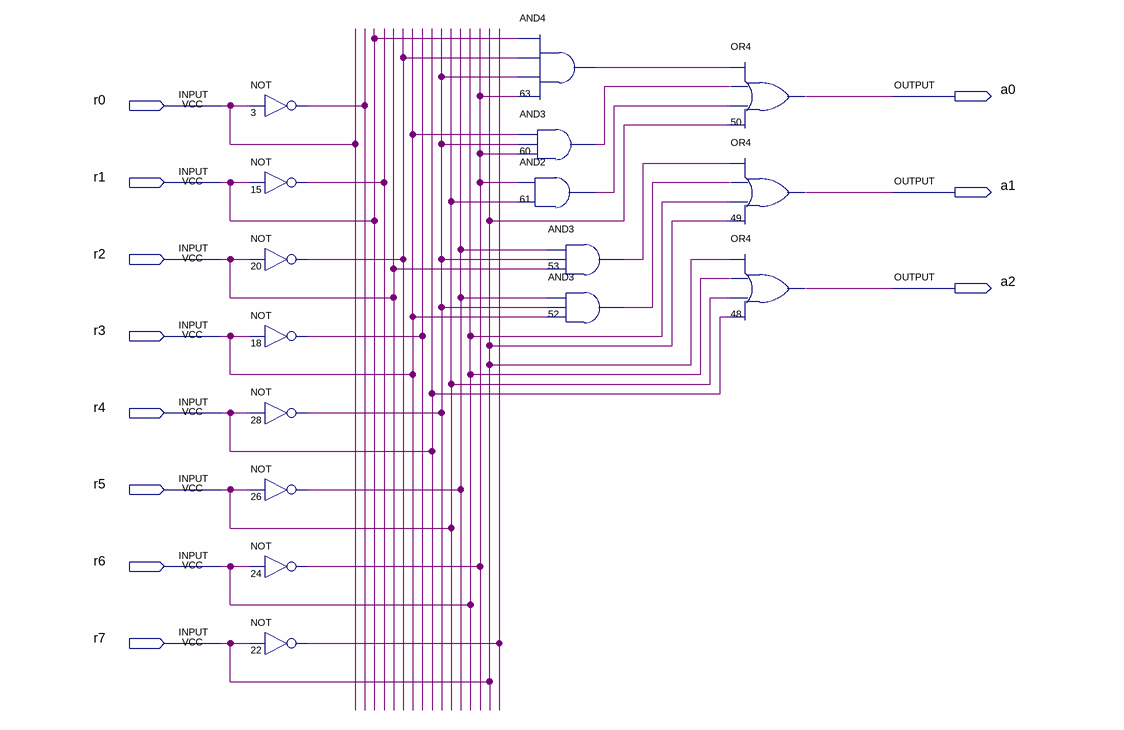
[diagram p0: schematic sheet]
// Quartus schematic cd8_3.bdf as structural Verilog: 16 symbols, 11 pins
module cd8_3 (
  input  r0,
  input  r1,
  input  r2,
  input  r3,
  input  r4,
  input  r5,
  input  r6,
  input  r7,
  output a0,
  output a1,
  output a2
);

  wire n3_out, n15_out, n18_out, n20_out, n22_out, n24_out, n26_out, n28_out, n52_out, n53_out, n60_out,
       n61_out, n63_out;

  not u_3 (n3_out, r0);
  not u_15 (n15_out, r1);
  not u_20 (n20_out, r2);
  not u_18 (n18_out, r3);
  not u_28 (n28_out, r4);
  not u_26 (n26_out, r5);
  not u_24 (n24_out, r6);
  not u_22 (n22_out, r7);
  and u_63 (n63_out, r1, n20_out, n28_out, n24_out);
  and u_60 (n60_out, r3, n28_out, n24_out);
  and u_61 (n61_out, n24_out, r5);
  and u_53 (n53_out, n26_out, n28_out, r2);
  and u_52 (n52_out, n26_out, n28_out, r3);
  or u_50 (a0, n63_out, n60_out, n61_out, r7);
  or u_49 (a1, n53_out, n52_out, r6, r7);
  or u_48 (a2, r7, r6, r5, r4);
endmodule
